# EAGLE design LightTable_Borders_CM_SP_ExternalMirror (EAGLE 9.6.2)
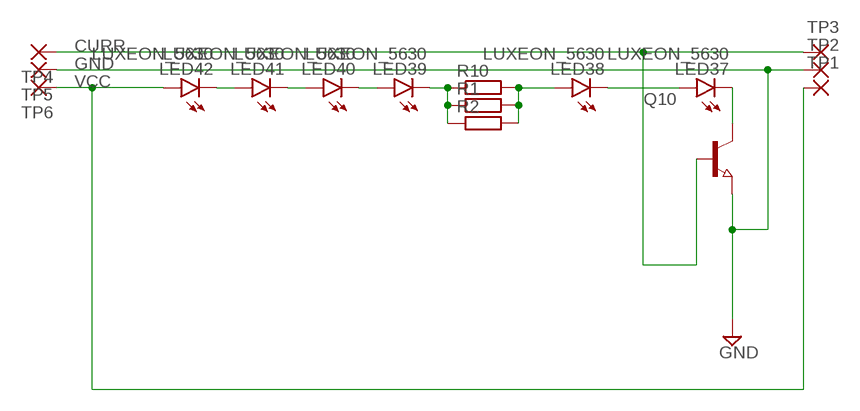
[diagram p0: schematic, sheet 1]

## Parts
LED37  LUXEON_5630  [LUXEON_5630]
LED38  LUXEON_5630  [LUXEON_5630]
LED39  LUXEON_5630  [LUXEON_5630]
LED40  LUXEON_5630  [LUXEON_5630]
LED41  LUXEON_5630  [LUXEON_5630]
LED42  LUXEON_5630  [LUXEON_5630]
Q10  NPN-TRANSISTOR_SOT23  [SOT23]
R1  R-EU_R0805  [R0805]
R2  R-EU_R0805  [R0805]
R10  R-EU_R0805  [R0805]
TP1  LSP10  1,6/0,8  [1,6/0,8]
TP2  LSP10  1,6/0,8  [1,6/0,8]
TP3  LSP10  1,6/0,8  [1,6/0,8]
TP4  LSP10  1,6/0,8  [1,6/0,8]
TP5  LSP10  1,6/0,8  [1,6/0,8]
TP6  LSP10  1,6/0,8  [1,6/0,8]

## Nets
CURR: Q10.1(B) TP3.1(P) TP4.1(P)
GND: Q10.2(E) TP2.1(P) TP5.1(P)
N$1: LED39.1@1(C) LED39.1@2(C) R1.1 R2.1 R10.1
N$2: LED38.2(A) R1.2 R2.2 R10.2
N$3: LED37.2(A) LED38.1@1(C) LED38.1@2(C)
N$58: LED37.1@1(C) LED37.1@2(C) Q10.3(C)
N$62: LED39.2(A) LED40.1@1(C) LED40.1@2(C)
N$63: LED40.2(A) LED41.1@1(C) LED41.1@2(C)
N$64: LED41.2(A) LED42.1@1(C) LED42.1@2(C)
VCC: LED42.2(A) TP1.1(P) TP6.1(P)

## Library data of the parts
LED37-LED42 = led:LUXEON_5630: LUXEON 5630 Mid-Power LEDs SD201 Source: Data sheet <www.philipslumileds.com/uploads/351/DS201-pdf> Lumileds 5630 Datasheet DS201 20130228 ©2013 Philips Lumileds Lighting Company.
Q10 = semicon-smd-ipc:NPN-TRANSISTOR_: NPN TRANSISTOR
R1 R2 R10 = rcl:R-EU_: RESISTOR, European symbol; SPICEPREFIX: R
TP1-TP6 = wirepad:1,6/0,8: THROUGH-HOLE PAD

## Board
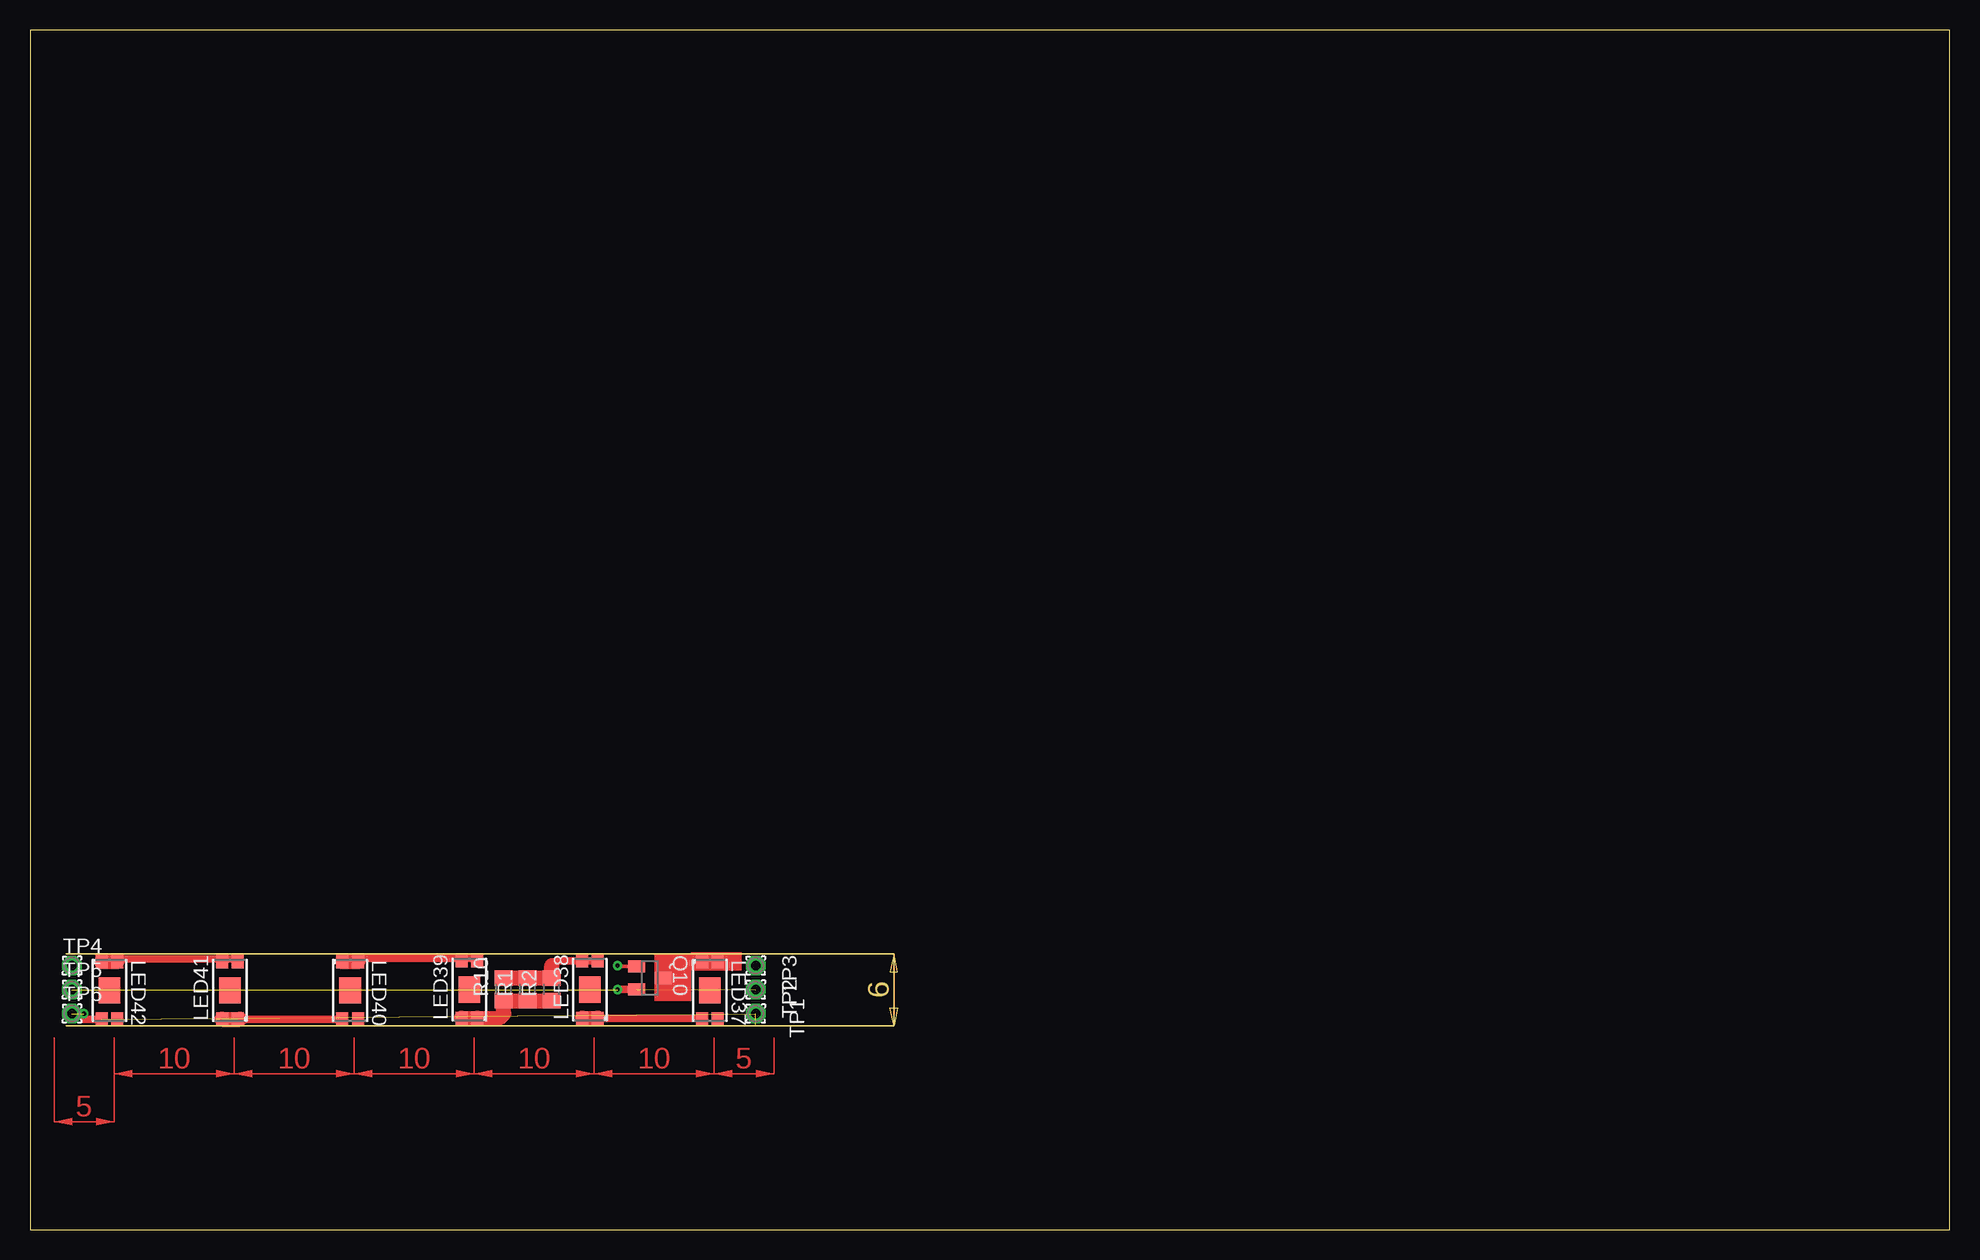
[diagram p1: board, top side]
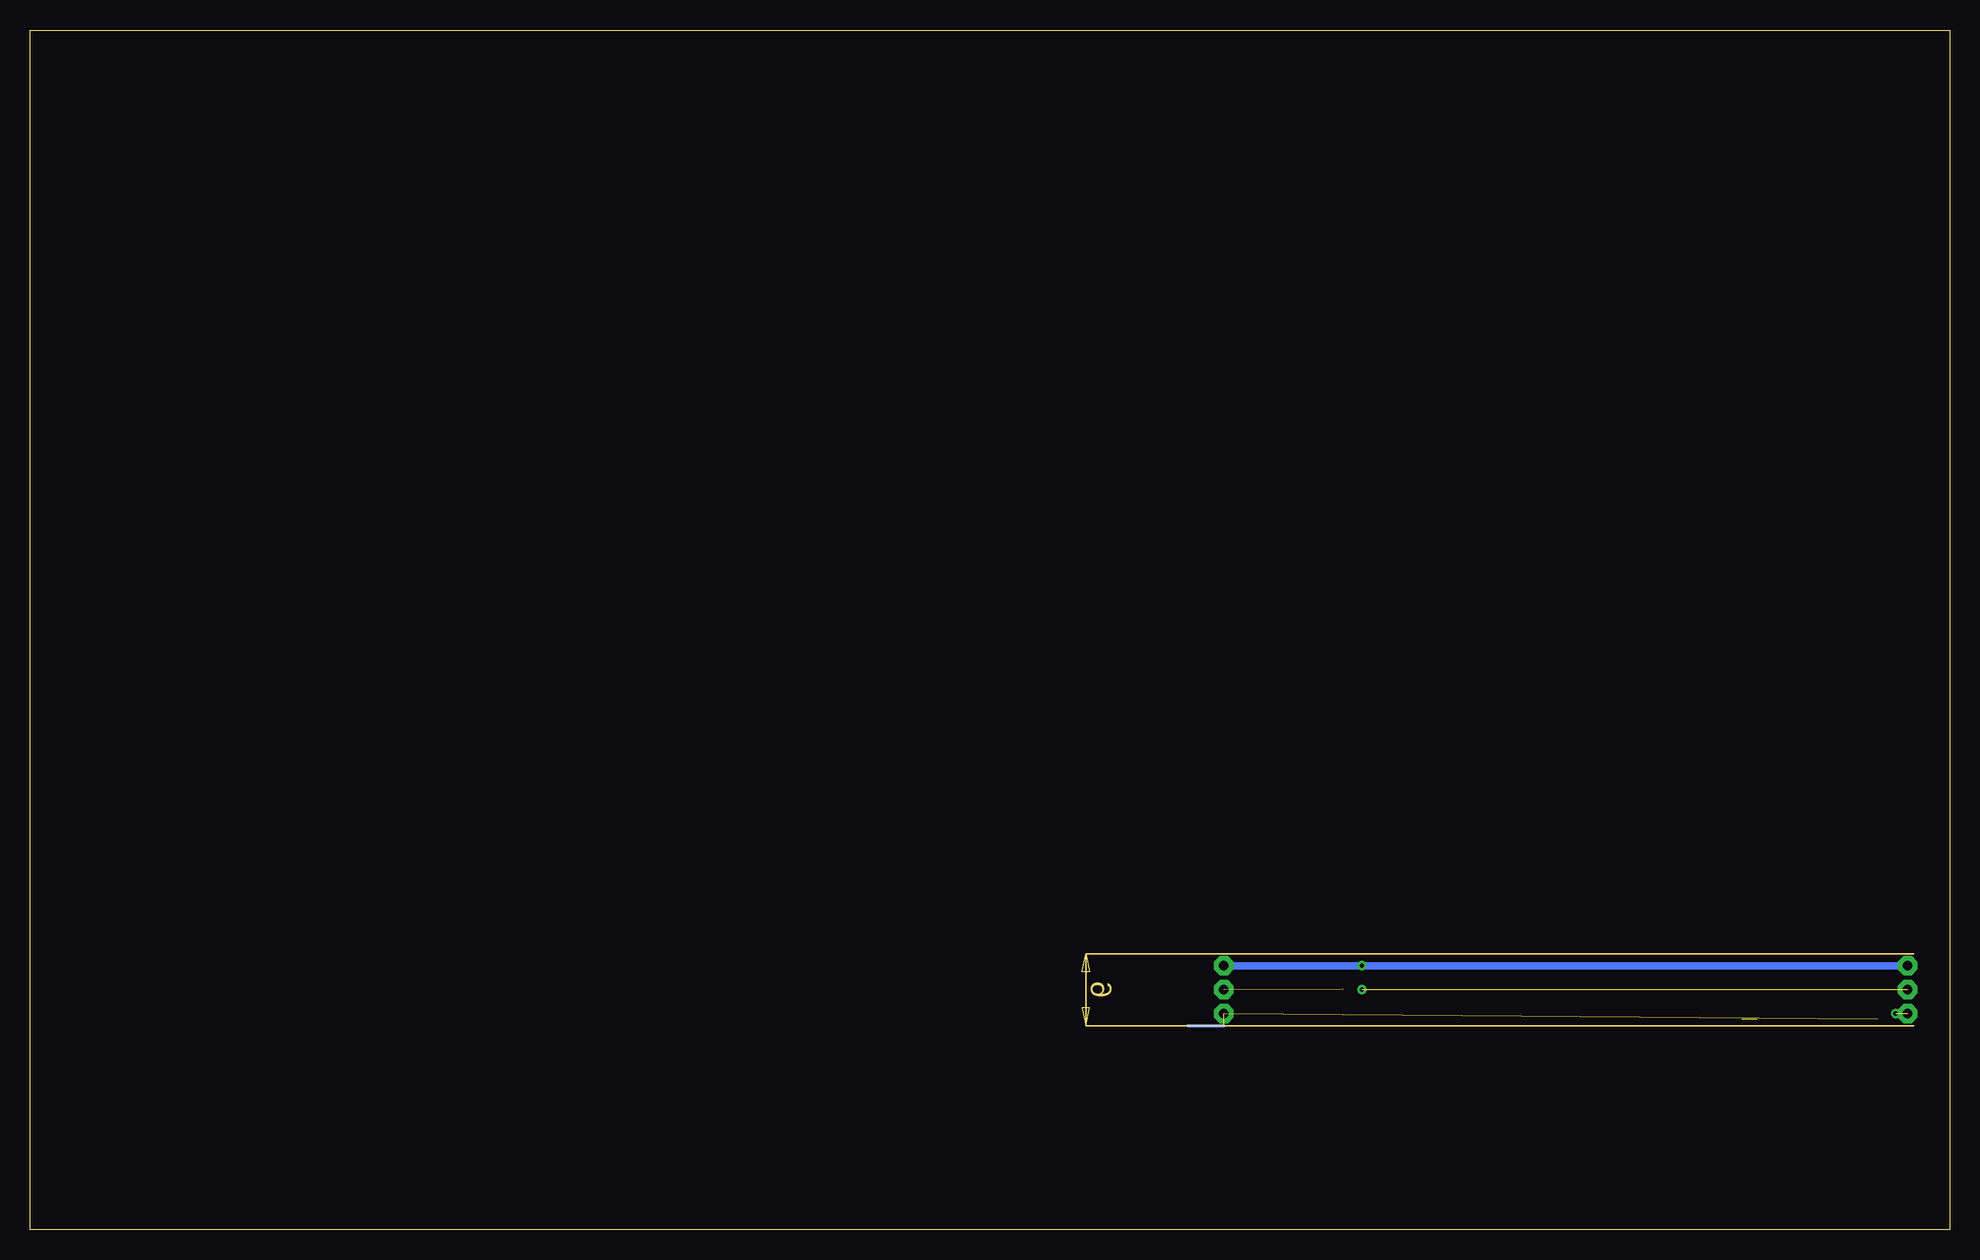
[diagram p2: board, bottom side, seen from below]

Size 160 x 100 mm. Coordinates in mm from the lower left corner, seen from the top.
Outline: 0,0 160,0 160,100 0,100 0,0
Copper layers (1*16): Top 0.035mm / dielectric 1.5mm / Bottom 0.035mm
Design rules "default": minimum track width 6mil, minimum drill 0.35mm, track to track 6mil, track to pad 6mil, pad to pad 6mil, via to via 6mil, smd to smd 6mil, copper to edge 40mil, drill to drill 6mil, minimum pad ring 10mil, minimum via ring 8mil, stop-mask expansion 4mil, vias tented up to drill 0mil, thermal gap 10mil

### Footprints (pad centres in the part's own frame; a part is rotated, then mirrored left to right if it is on the bottom)
LUXEON_5630 = smd 1.1 x 1: 1@1 -2.4,-0.65; 1@2 -2.4,0.65; 2 2.4,-0.65; 4 2.4,0.65 | smd 2.2 x 1.8: 3 0,0
SOT23 = smd 1 x 1.4: 1 -0.95,-1.1; 2 0.95,-1.1; 3 0,1.1
R0805 = smd 1.3 x 1.5: 1 -0.95,0; 2 0.95,0
1,6/0,8 = drill 0.813 pad 1.6 octagon: 1 0,0

### Placement (x,y rotation side)
LED37  56.66,19.94 270 top
LED38  46.68,20 90 top
LED39  36.63,20 90 top
LED40  26.69,19.94 270 top
LED41  16.65,19.94 90 top
LED42  6.62,19.94 270 top
Q10  51.67,20.97 270 top
R1  41.48,20.02 90 top
R2  43.48,20.02 90 top
R10  39.48,20.02 90 top
TP1  60.49,18 270 top
TP2  60.49,20 270 top
TP3  60.49,22 270 top
TP4  3.49,22 0 top
TP5  3.49,20 0 top
TP6  3.49,18 0 top

### Tracks (layer width: path | path; a pad name or v marks a point on that pad's centre or on a via)
CURR  (via drill 0.35)
  Top 0.3: Q10.1 48.98,21.92 v48.98,22
  Bottom 0.3: v48.98,22 48.93,22.05
  Bottom 0.61: TP4.1 v48.98,22 TP3.1
GND  (via drill 0.35)  (2 unrouted)
  Top 0.3: 49,20.02 v48.98,20
  Top 0.61: Q10.2 49,20.02
N$1
  Top 1.27: R2.1 R1.1 R10.1 39.49,19.07 39.49,18 39.1,17.61 LED39.1@1 LED39.1@2
N$2
  Top 0.61: LED38.2 47.32,22.41 43.9,22.41 43.49,22
  Top 1.27: R10.2 R1.2 R2.2 43.48,21.99 43.49,22
N$3
  Top 0.3: LED37.2 55.94,17.61
  Top 0.61: 55.94,17.61 LED38.1@1
  Top 1.27: LED38.1@2 LED38.1@1
N$58
  Top 0.61: Q10.3 52.77,22.34 LED37.1@2 LED37.1@1
  Top 1.27: LED37.1@2 57.41,22.34 57.42,22.35
N$62
  Top 0.3: LED40.1@1 26.31,22.61 | LED39.2 37.07,22.61
  Top 0.61: 37.07,22.61 26.31,22.61
  Top 1.27: LED40.1@1 LED40.1@2
N$63  (1 unrouted)
  Top 0.61: 17.49,17.54 LED40.2
  Top 1.27: LED41.1@2 17.49,17.54
N$64
  Top 0.3: LED41.2 17.09,22.55 | LED42.1@1 6.18,22.55
  Top 0.61: 17.09,22.55 6.18,22.55
  Top 1.27: LED42.1@1 LED42.1@2
VCC  (via drill 0.35)  (3 unrouted)
  Top 0.61: LED42.2 4.49,17.54 v4.49,18
  Bottom 0.3: 63.49,17 60.49,17
(copper drawn outside any net)
  shapes: Top area x9